# EasyEDA Pro project 【JHP硬件工作室】参考工程.epro

# Schematic user
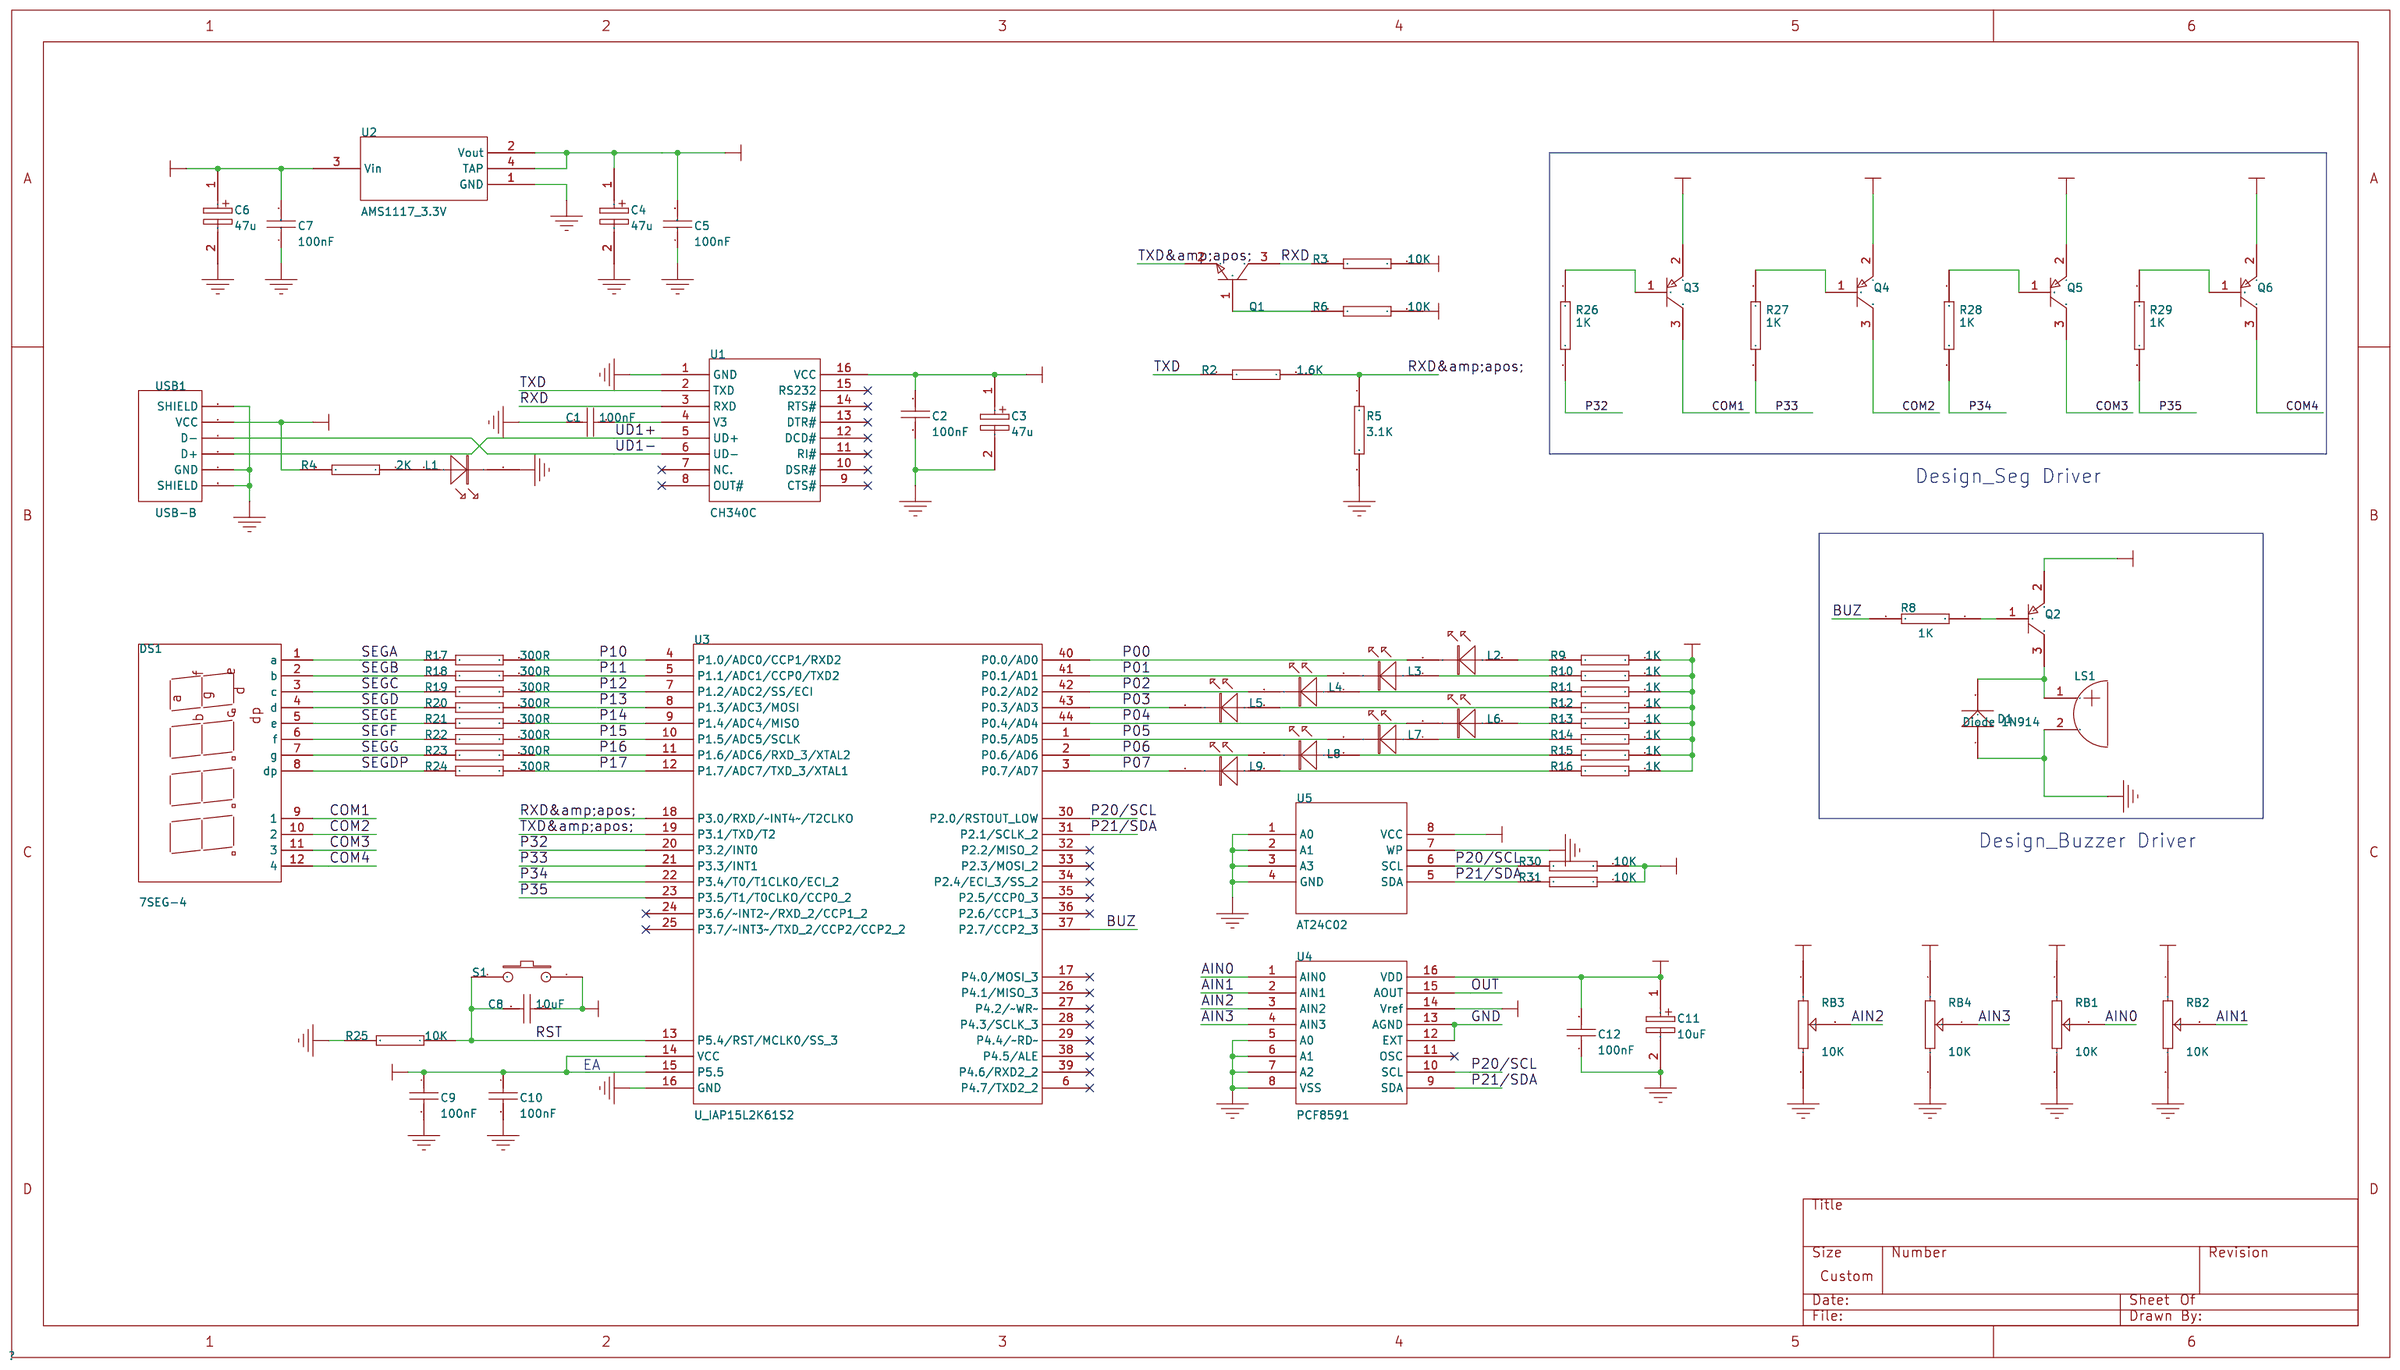
[diagram p0: schematic sheet]

## Parts
C1  100nF  [C0805]
C2  100nF  [C0805]
C3  47u  [CAP-2]
C4  47u  [CAP-2]
C5  100nF  [C0805]
C6  47u  [CAP-2]
C7  100nF  [C0805]
C8  10uF  [C0805]
C9  100nF  [C0805]
C10  100nF  [C0805]
C11  10uF  [CAP-2]
C12  100nF  [C0805]
D1  Diode 1N914  [DIODE]
DS1  7SEG-4  [D_SEG-0.36]
L1  LED  [LED0805]
L2  LED  [LED0805]
L3  LED  [LED0805]
L4  LED  [LED0805]
L5  LED  [LED0805]
L6  LED  [LED0805]
L7  LED  [LED0805]
L8  LED  [LED0805]
L9  LED  [LED0805]
LS1  S_BUZZER  [BUZZ]
Q1  8050-SOT23  [SOT23-3]
Q2  2N3906  [SOT23-3]
Q3  2N3906  [SOT23-3]
Q4  2N3906  [SOT23-3]
Q5  2N3906  [SOT23-3]
Q6  2N3906  [SOT23-3]
R2  1.6K  [R0805]
R3  10K  [R0805]
R4  2K  [R0805]
R5  3.1K  [R0805]
R6  10K  [R0805]
R8  1K  [R0805]
R9  1K  [R0805]
R10  1K  [R0805]
R11  1K  [R0805]
R12  1K  [R0805]
R13  1K  [R0805]
R14  1K  [R0805]
R15  1K  [R0805]
R16  1K  [R0805]
R17  300R  [R0805]
R18  300R  [R0805]
R19  300R  [R0805]
R20  300R  [R0805]
R21  300R  [R0805]
R22  300R  [R0805]
R23  300R  [R0805]
R24  300R  [R0805]
R25  10K  [R0805]
R26  1K  [R0805]
R27  1K  [R0805]
R28  1K  [R0805]
R29  1K  [R0805]
R30  10K  [R0805]
R31  10K  [R0805]
RB1  10K  [RB]
RB2  10K  [RB]
RB3  10K  [RB]
RB4  10K  [RB]
S1  SW-PB  [Switch]
U1  CH340C  [SO-16_N]
U2  AMS1117_3.3V  [SOT-223]
U3  U_IAP15L2K61S2  [LQFP-44]
U4  PCF8591  [SO-16_W]
U5  AT24C02  [SO-8]
USB1  USB-B  [USB-B]

## Library data of the parts
C1 C2 C9 C10 = 100nF: Design Item ID: CAP; Library Name: *
C3 C4 C6 = 47u: Electrolytic Capacitor; Library Name: user
C5 C7 = 100nF: Capacitor; 中文名称: 贴片电容; Design Item ID: C_CAP; Library Name: Altium-library
C8 = 10uF: Design Item ID: CAP; Library Name: *
C11 = 10uF: Electrolytic Capacitor; Design Item ID: ELECTRO2; Library Name: *
C12 = 100nF: Capacitor; Design Item ID: CAP; Library Name: *
D1 = Diode 1N914: High Conductance Fast Diode; Library Name: Miscellaneous Devices
DS1 = 7SEG-4: 4 Seven-Segment Display, Right Hand Decimal; Library Name: *
L1-L9 = LED: Library Name: *
LS1 = S_BUZZER: Library Name: Altium
Q1 = 8050-SOT23: PNP-S8050; 中文名称: 三极管; Design Item ID: Q_NPN; Library Name: Altium
Q2-Q6 = 2N3906: PNP General Purpose Amplifier; Library Name: Miscellaneous Devices
R2 = 1.6K: Design Item ID: RES2; Library Name: *
R3 R6 R25 R30 R31 = 10K: Design Item ID: RES2; Library Name: *
R4 = 2K: Design Item ID: RES2; Library Name: *
R5 = ?: Design Item ID: RES2; Library Name: *
R8-R16 R26-R29 = 1K: Design Item ID: RES2; Library Name: *
R17-R24 = 300R: Design Item ID: RES2; Library Name: *
RB1-RB4 = 10K: Potentiometer; Design Item ID: POT2; Library Name: *
S1 = SW-PB: Library Name: user
U1 = CH340C: Library Name: user
U2 = AMS1117_3.3V: POWER; 中文名称: 稳压芯片; Design Item ID: U_ASM1117; Library Name: Altium-library
U3 = U_IAP15L2K61S2: MCU; 中文名称: STC15系列单片机; Design Item ID: U_IAP15F2K61S2; Library Name: Company-library_2018年11月21日
U4 = PCF8591: Library Name: *
U5 = AT24C02: Library Name: *
USB1 = USB-B: Connector; Design Item ID: USB_A; Library Name: *

## Nets
+3V3: C4.1 C5.2 C8.2 C9.1 C10.1 C11.1 C12.2 Q2.2(E) Q3.2(E) Q4.2(E) Q5.2(E) Q6.2(E) R6.1 R9.2 R10.2 R11.2 R12.2 R13.2 R14.2 R15.2 R16.2 R30.1 R31.1 RB1.1 RB2.1 RB3.1 RB4.1 S1.2 U2.2(Vout) U2.4(TAP) U3.14(VCC) U3.15(P5.5) U4.14(Vref) U4.16(VDD) U5.8(VCC)
+5V: C2.1 C3.1 C6.1 C7.2 R3.1 R4.2 U1.16(VCC) U2.3(Vin) USB1.1(VCC)
GND: C1.1 C2.2 C3.2 C4.2 C5.1 C6.2 C7.1 C9.2 C10.2 C11.2 C12.1 D1.1(A) L1.2(K) LS1.2 R5.2 R25.2 RB1.3(2) RB2.3(2) RB3.3(2) RB4.3(2) U1.1(GND) U2.1(GND) U3.16(GND) U4.5(A0) U4.6(A1) U4.7(A2) U4.8(VSS) U4.12(EXT) U4.13(AGND) U5.1(A0) U5.2(A1) U5.3(A3) U5.4(GND) U5.7(WP) USB1.4(GND) USB1.5(SHIELD) USB1.6(SHIELD)
AIN0: RB1.2(W) U4.1(AIN0)
AIN1: RB2.2(W) U4.2(AIN1)
AIN2: RB3.2(W) U4.3(AIN2)
AIN3: RB4.2(W) U4.4(AIN3)
BUZ: R8.1 U3.37(P2.7/CCP2_3)
COM1: DS1.9(1) Q3.3(C)
COM2: DS1.10(2) Q4.3(C)
COM3: DS1.11(3) Q5.3(C)
COM4: DS1.12(4) Q6.3(C)
OUT: U4.15(AOUT)
P00: L2.2(K) U3.40(P0.0/AD0)
P01: L3.2(K) U3.41(P0.1/AD1)
P02: L4.2(K) U3.42(P0.2/AD2)
P03: L5.2(K) U3.43(P0.3/AD3)
P04: L6.2(K) U3.44(P0.4/AD4)
P05: L7.2(K) U3.1(P0.5/AD5)
P06: L8.2(K) U3.2(P0.6/AD6)
P07: L9.2(K) U3.3(P0.7/AD7)
P10: R17.2 U3.4(P1.0/ADC0/CCP1/RXD2)
P11: R18.2 U3.5(P1.1/ADC1/CCP0/TXD2)
P12: R19.2 U3.7(P1.2/ADC2/SS/ECI)
P13: R20.2 U3.8(P1.3/ADC3/MOSI)
P14: R21.2 U3.9(P1.4/ADC4/MISO)
P15: R22.2 U3.10(P1.5/ADC5/SCLK)
P16: R23.2 U3.11(P1.6/ADC6/RXD_3/XTAL2)
P17: R24.2 U3.12(P1.7/ADC7/TXD_3/XTAL1)
P20/SCL: R30.2 U3.30(P2.0/RSTOUT_LOW) U4.10(SCL) U5.6(SCL)
P21/SDA: R31.2 U3.31(P2.1/SCLK_2) U4.9(SDA) U5.5(SDA)
P32: R26.1 U3.20(P3.2/INT0)
P33: R27.1 U3.21(P3.3/INT1)
P34: R28.1 U3.22(P3.4/T0/T1CLKO/ECI_2)
P35: R29.1 U3.23(P3.5/T1/T0CLKO/CCP0_2)
RST: C8.1 R25.1 S1.1 U3.13(P5.4/RST/MCLK0/SS_3)
RXD: Q1.3(C) R3.2 U1.3(RXD)
RXD&amp;apos;: R2.1 R5.1 U3.18(P3.0/RXD/~INT4~/T2CLKO)
SEGA: DS1.1(a) R17.1
SEGB: DS1.2(b) R18.1
SEGC: DS1.3(c) R19.1
SEGD: DS1.4(d) R20.1
SEGDP: DS1.8(dp) R24.1
SEGE: DS1.5(e) R21.1
SEGF: DS1.6(f) R22.1
SEGG: DS1.7(g) R23.1
TXD: R2.2 U1.2(TXD)
TXD&amp;apos;: Q1.2(E) U3.19(P3.1/TXD/T2)
UD1+: U1.5(UD+) USB1.3(D+)
UD1-: U1.6(UD-) USB1.2(D-)
$1N776: L2.1(A) R9.1
$1N777: L4.1(A) R11.1
$1N778: L5.1(A) R12.1
$1N779: L7.1(A) R14.1
$1N780: L8.1(A) R15.1
$1N781: L9.1(A) R16.1
$1N782: L3.1(A) R10.1
$1N783: L6.1(A) R13.1
$1N790: C1.2 U1.4(V3)
$1N933: Q1.1(B) R6.2
$1N948: L1.1(A) R4.1
$1N2567: Q3.1(B) R26.2
$1N2650: Q4.1(B) R27.2
$1N2787: Q5.1(B) R28.2
$1N2856: Q6.1(B) R29.2
$1N2876: Q2.1(B) R8.2
$1N2914: D1.2(K) LS1.1 Q2.3(C)

Not connected (* = marked no-connect by the designer): U1 7(NC.)* 8(OUT#)* 9(CTS#)* 10(DSR#)* 11(RI#)* 12(DCD#)* 13(DTR#)* 14(RTS#)* 15(RS232)*; U3 6(P4.7/TXD2_2)* 17(P4.0/MOSI_3)* 24(P3.6/~INT2~/RXD_2/CCP1_2)* 25(P3.7/~INT3~/TXD_2/CCP2/CCP2_2)* 26(P4.1/MISO_3)* 27(P4.2/~WR~)* 28(P4.3/SCLK_3)* 29(P4.4/~RD~)* 32(P2.2/MISO_2)* 33(P2.3/MOSI_2)* 34(P2.4/ECI_3/SS_2)* 35(P2.5/CCP0_3)* 36(P2.6/CCP1_3)* 38(P4.5/ALE)* 39(P4.6/RXD2_2)*; U4 11(OSC)*

## Notes on the sheet
- Design_Seg Driver
- Design_Buzzer Driver
- EA

# Board user
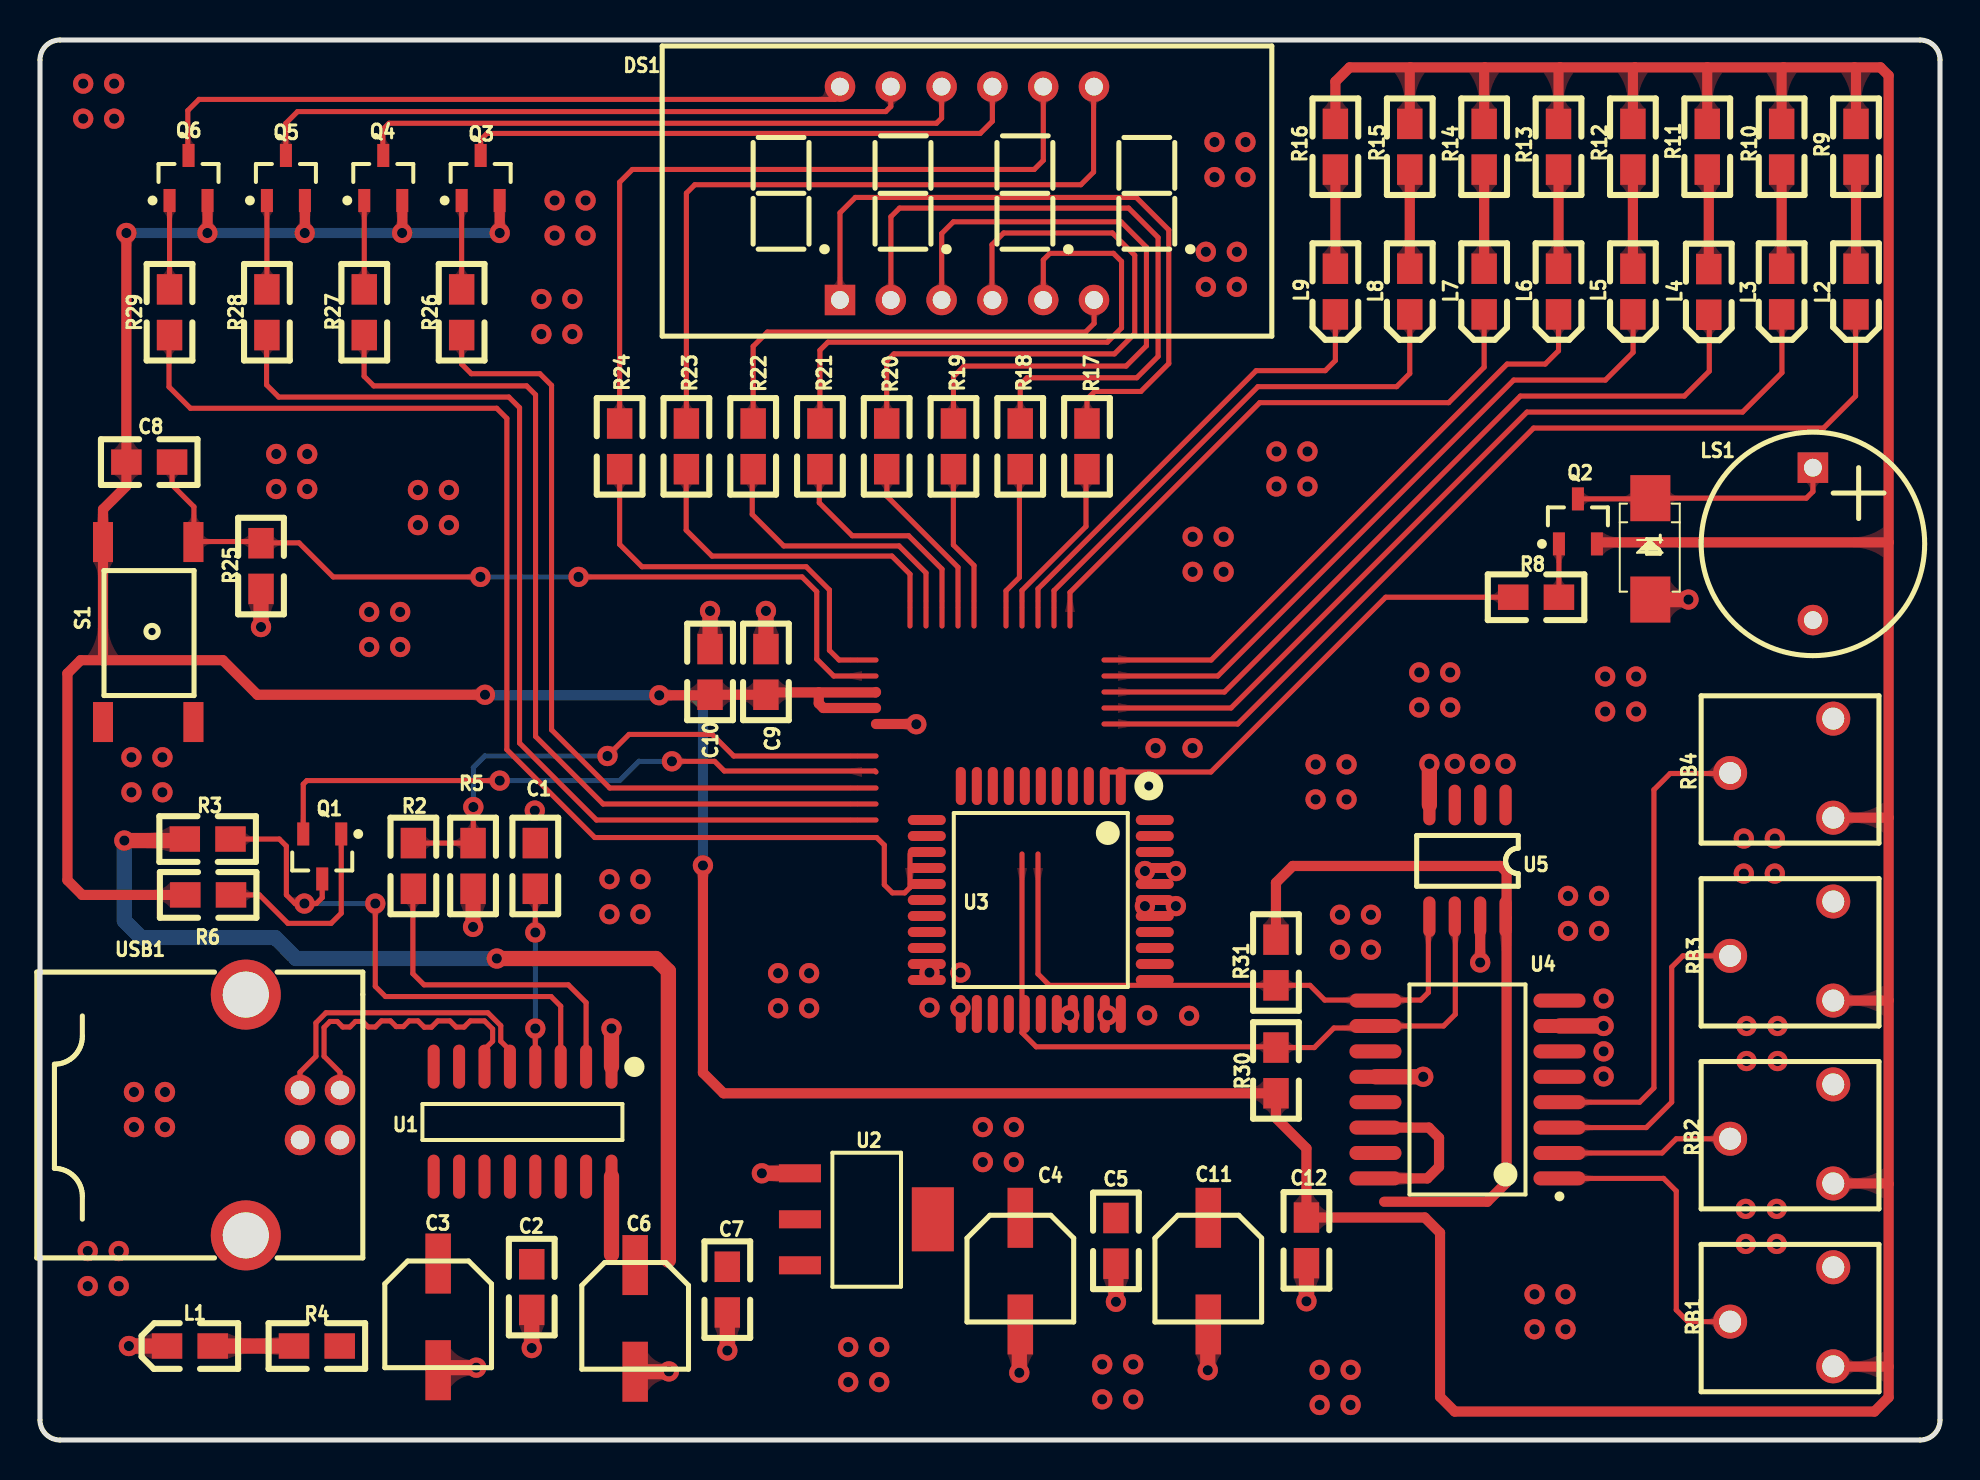
[diagram p1: board, top side]
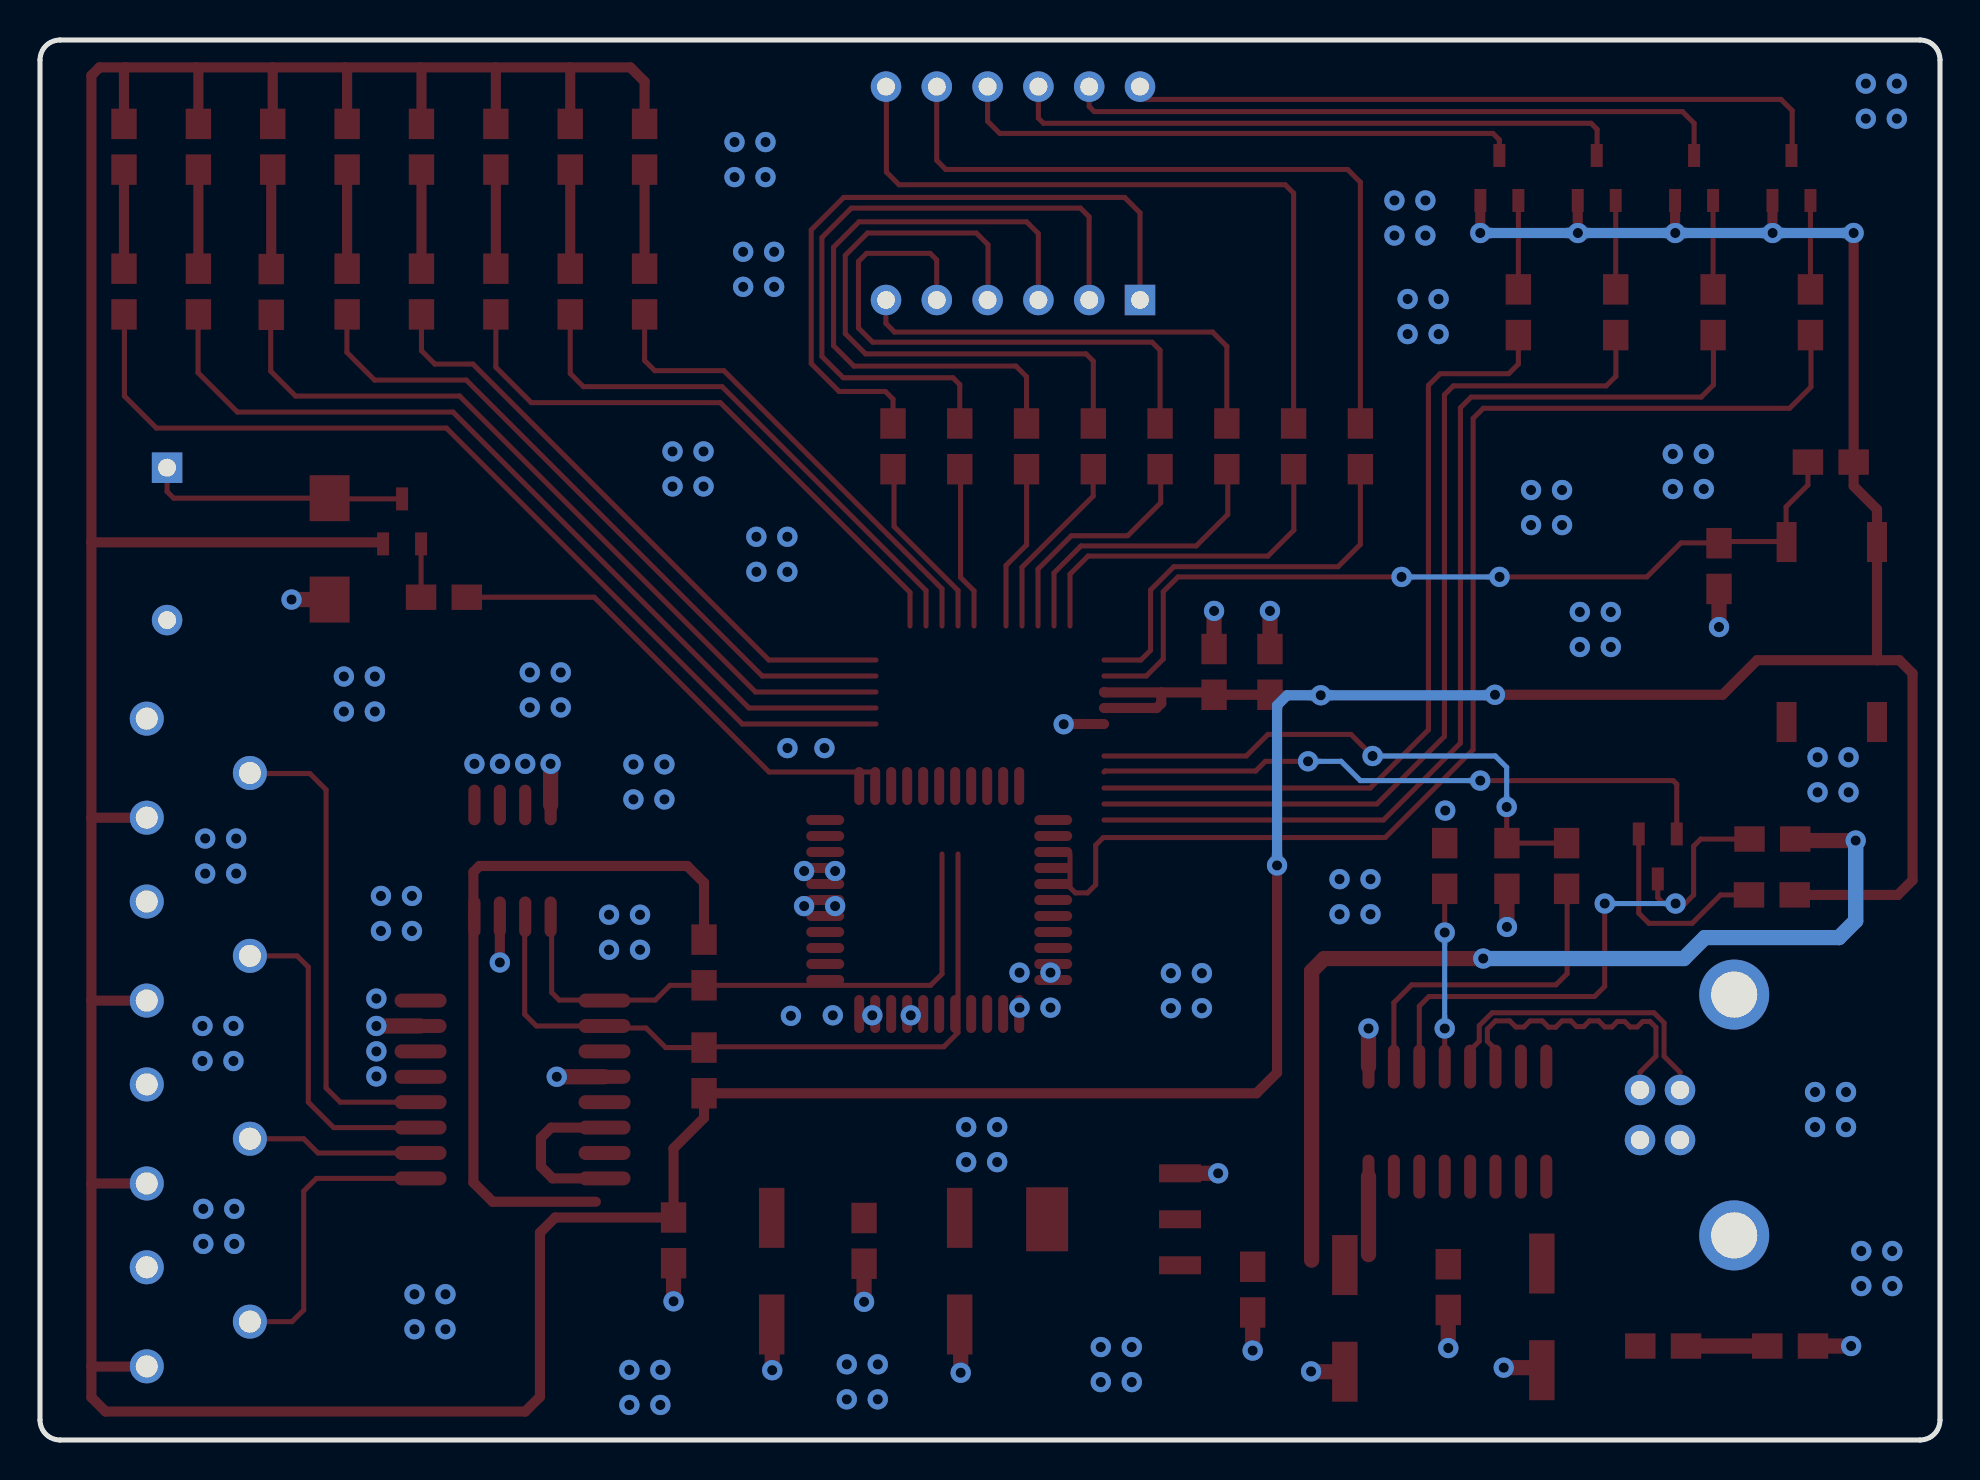
[diagram p2: board, bottom side, seen from below]

Outline 95 x 70 mm; copper layers: Top Layer, Bottom Layer. Coordinates in mm from the lower left corner of the outline.
Outline path: 0,69 0,1 arc(0.29,0.29) 1,0 94,0 arc(94.71,0.29) 95,1 95,69 arc(94.71,69.71) 94,70 1,70 arc(0.29,69.71) 0,69
Stack: Top Layer 0.035mm / Dielectric1 1.51mm FR4 er 4.5 / Bottom Layer 0.035mm

## Design rules (mm)
net UD1-: DP1
net UD1+: DP1
template: 自定义配置
spacing copperThickness1oz (default): track to track 0.254, other pairs 0.254 to 0.762
spacing copperThickness2oz: track to track 0.203, other pairs 0.152 to 0.3
track width copperThickness1oz (default): min 0.254, default 0.254, max 1.27
track width copperThickness2oz: min 0.203, default 0.254, max 2.54
track width 3V3: min 0.508, default 0.508, max 0.508
track width 5V: min 0.762, default 0.762, max 0.762
differential pair differentialPair (default): width min 0.127, default 0.254, max 2.54; gap min 0.152, default 0.152
via viaSize (default): diameter min 1.016, default 1.016, max 1.016; hole min 0.508, default 0.508, max 0.508
net +5V uses 5V
net +3V3 uses 3V3

## Placement (name value [footprint] x y rotation side)
C1  100nF  [C0805]  24.77 29.84 270 top
C2  100nF  [C0805]  24.59 8.79 270 top
C3  47u  [CAP-2]  19.41 7.19 270 top
C4  47u  [CAP-2]  48.51 9.47 270 top
C5  100nF  [C0805]  53.8 8.81 90 top
C6  47u  [CAP-2]  29.26 7.11 270 top
C7  100nF  [C0805]  34.37 6.38 90 top
C8  10uF  [C0805]  6.6 48.89 180 top
C9  100nF  [C0805]  36.3 37.26 90 top
C10  100nF  [C0805]  33.5 37.26 90 top
C11  10uF  [CAP-2]  57.91 9.47 270 top
C12  100nF  [C0805]  63.32 8.84 90 top
D1  Diode 1N914  [DIODE]  80.52 42.01 90 top
DS1  7SEG-4  [D_SEG-0.36]  40 57 0 top
L1  LED  [LED0805]  6.35 4.7 0 top
L2  LED  [LED0805]  90.8 56.28 90 top
L3  LED  [LED0805]  87.08 56.28 90 top
L4  LED  [LED0805]  83.44 56.26 90 top
L5  LED  [LED0805]  79.64 56.28 90 top
L6  LED  [LED0805]  75.93 56.28 90 top
L7  LED  [LED0805]  72.21 56.28 90 top
L8  LED  [LED0805]  68.49 56.28 90 top
L9  LED  [LED0805]  64.77 56.28 90 top
LS1  S_BUZZER  [BUZZ]  88.65 48.62 270 top
Q1  8050-SOT23  [SOT23-3]  15.06 30.3 270 top
Q2  2N3906  [SOT23-3]  75.95 44.81 90 top
Q3  2N3906  [SOT23-3]  21.08 61.98 90 top
Q4  2N3906  [SOT23-3]  16.21 61.98 90 top
Q5  2N3906  [SOT23-3]  11.35 61.98 90 top
Q6  2N3906  [SOT23-3]  6.48 61.98 90 top
R2  1.6K  [R0805]  18.67 29.84 270 top
R3  10K  [R0805]  7.24 30.05 0 top
R4  2K  [R0805]  12.7 4.7 0 top
R5  3.1K  [R0805]  21.65 29.84 270 top
R6  10K  [R0805]  7.26 27.25 0 top
R8  1K  [R0805]  73.66 42.14 0 top
R9  1K  [R0805]  90.8 63.52 90 top
R10  1K  [R0805]  87.08 63.52 90 top
R11  1K  [R0805]  83.36 63.52 90 top
R12  1K  [R0805]  79.64 63.52 90 top
R13  1K  [R0805]  75.93 63.52 90 top
R14  1K  [R0805]  72.21 63.52 90 top
R15  1K  [R0805]  68.49 63.52 90 top
R16  1K  [R0805]  64.77 63.52 90 top
R17  300R  [R0805]  52.35 50.83 270 top
R18  300R  [R0805]  49.01 50.83 270 top
R19  300R  [R0805]  45.67 50.83 270 top
R20  300R  [R0805]  42.33 50.83 270 top
R21  300R  [R0805]  39 50.83 270 top
R22  300R  [R0805]  35.66 50.83 270 top
R23  300R  [R0805]  32.32 50.83 270 top
R24  300R  [R0805]  28.98 50.83 270 top
R25  10K  [R0805]  11.05 44.84 270 top
R26  1K  [R0805]  21.08 55.25 90 top
R27  1K  [R0805]  16.21 55.25 90 top
R28  1K  [R0805]  11.35 55.25 90 top
R29  1K  [R0805]  6.48 55.25 90 top
R30  10K  [R0805]  61.8 17.34 90 top
R31  10K  [R0805]  61.8 25.02 270 top
RB1  10K  [RB]  89.66 3.68 270 top
RB2  10K  [RB]  89.66 12.83 270 top
RB3  10K  [RB]  89.66 21.97 270 top
RB4  10K  [RB]  89.66 31.11 270 top
S1  SW-PB  [Switch]  5.46 40.39 90 top
U1  CH340C  [SO-16_N]  28.57 18.67 270 top
U2  AMS1117_3.3V  [SOT-223]  38 13.33 0 top
U3  U_IAP15L2K61S2  [LQFP-44]  47.5 35 270 top
U4  PCF8591  [SO-16_W]  71.37 17.53 180 top
U5  AT24C02  [SO-8]  73.28 31.75 270 top
USB1  -  [USB-B]  15 15 270 top

## Footprints (pads in the part's own frame, mm; a bottom-side part is the same pattern mirrored in y, then rotated)
BUZZ
  rect 1.524x1.524 hole 0.889: 1(0,0)
  round 1.524 hole 0.889: 2(7.62,0)
C0805
  rect 1.524x1.27 smd: 1(0,0) 2(2.286,0)
CAP-2
  rect 3x1.274 smd: 1(-1.635,0.502) 2(3.699,0.502)
D_SEG-0.36
  rect 1.524x1.524 hole 0.889: 1(0,0)
  round 1.524 hole 0.889: 2(2.54,0) 3(5.08,0) 4(7.62,0) 5(10.16,0) 6(12.7,0) 7(12.7,10.668) 8(10.16,10.668) 9(7.62,10.668) 10(5.08,10.668) 11(2.54,10.668) 12(0,10.668)
DIODE
  rect 2.3x2 smd: 1(0.01,0) 2(5.08,0)
LED0805
  rect 1.524x1.27 smd: 1(2.286,0) 2(0,0)
LQFP-44
  oval 1.9x0.5 smd: 1(2.301,6.54) 2(2.301,5.74) 3(2.301,4.94) 4(2.301,4.14) 5(2.301,3.34) 6(2.301,2.54) 7(2.301,1.74) 8(2.301,0.94) 9(2.301,0.14) 10(2.301,-0.66) 11(2.301,-1.46) 23(13.701,-1.46) 24(13.701,-0.66) 25(13.701,0.14) 26(13.701,0.94) 27(13.701,1.74) 28(13.701,2.54) 29(13.701,3.34) 30(13.701,4.14) 31(13.701,4.94) 32(13.701,5.74) 33(13.701,6.54)
  oval 0.5x1.9 smd: 12(4.001,-3.16) 13(4.801,-3.16) 14(5.601,-3.16) 15(6.401,-3.16) 16(7.201,-3.16) 17(8.001,-3.16) 18(8.801,-3.16) 19(9.601,-3.16) 20(10.401,-3.16) 21(11.201,-3.16) 22(12.001,-3.16) 34(12.001,8.24) 35(11.201,8.24) 36(10.401,8.24) 37(9.601,8.24) 38(8.801,8.24) 39(8.001,8.24) 40(7.201,8.24) 41(6.401,8.24) 42(5.601,8.24) 43(4.801,8.24) 44(4.001,8.24)
R0805
  rect 1.524x1.27 smd: 1(0,0) 2(2.286,0)
RB
  round 1.7 hole 1.1: 1(0,0) 2(-2.235,-5.156) 3(-4.953,0)
SO-8
  oval 2.032x0.61 smd: 1(0,0) 2(0,-1.27) 3(0,-2.54) 4(0,-3.81) 5(5.588,-3.81) 6(5.588,-2.54) 7(5.588,-1.27) 8(5.588,0)
SO-16_N
  oval 2.2x0.6 smd: 1(0,0) 2(0,-1.27) 3(0,-2.54) 4(0,-3.81) 5(0,-5.08) 6(0,-6.35) 7(0,-7.62) 8(0,-8.89) 9(5.5,-8.89) 10(5.5,-7.62) 11(5.5,-6.35) 12(5.5,-5.08) 13(5.5,-3.81) 14(5.5,-2.54) 15(5.5,-1.27) 16(5.5,0)
SO-16_W
  oval 2.6x0.7 smd: 1(-4.6,4.445) 2(-4.6,3.175) 3(-4.6,1.905) 4(-4.6,0.635) 5(-4.6,-0.635) 6(-4.6,-1.905) 7(-4.6,-3.175) 8(-4.6,-4.445) 9(4.6,-4.445) 10(4.6,-3.175) 11(4.6,-1.905) 12(4.6,-0.635) 13(4.6,0.635) 14(4.6,1.905) 15(4.6,3.175) 16(4.6,4.445)
SOT23-3
  rect 1.15x0.6 smd: 1(0,0) 2(0,-1.9) 3(2.25,-0.95)
SOT-223
  rect 2.1x0.9 smd: 1(0,0) 2(0,-2.3) 3(0,-4.6)
  rect 2.1x3.2 smd: 4(6.644,-2.3)
Switch
  rect 2x1 smd: 1(4.503,-2.208) 2(4.503,2.312) 3(-4.497,2.312) 4(-4.497,-2.208)
USB-B
  round 1.524 hole 0.92: 1(0,0) 2(-2.5,0) 3(-2.5,-2) 4(0,-2)
  round 3.5 hole 2.3: 5(4.77,-4.71) 6(-7.27,-4.71)

## Nets
As in the schematic, except:
RXD&APOS;: R2.1 R5.1 U3.18
TXD&APOS;: Q1.2 U3.19

Pads without a net: S1 3 4; U1 7 8 9 10 11 12 13 14 15; U3 6 17 24 25 26 27 28 29 32 33 34 35 36 38 39; U4 11

## Via types
v1: diameter 1.016, hole 0.508, Top Layer to Bottom Layer, 174 vias

## Routing (per net, layer and track width the routed paths; a pad name or vN(x,y) marks a point on that pad's centre or on a via; arc(x,y) is an arc through that point)
+3V3: length 390.6
  Top Layer w0.508: 76,68.63 75.93,68.56 R13.2 ; 76,68.63 79.74,68.63 ; 76,68.63 72.24,68.63 ; R11.2 83.36,68.63 ; 83.36,68.63 79.74,68.63 ; 83.36,68.63 87.18,68.63 ; RB2.1 92.41,12.83 92.43,12.8 ; Q3.2 22.99,61.97 v1(22.99,60.35) ; 3.15,38.99 2.03,38.99 1.37,38.33 1.37,27.99 2.11,27.25 R6.1 ; 3.15,38.99 9.14,38.99 10.87,37.26 v1(22.25,37.26) ; 3.15,38.99 S1.2 3.15,46.53 4.32,47.7 C8.2 v1(4.32,60.35) ; 38.94,37.38 41.78,37.38 41.8,37.4 ; 38.94,37.38 38.94,36.83 39.17,36.6 41.8,36.6 ; 38.94,37.38 36.41,37.38 C9.1 C10.1 33.48,37.24 v1(30.96,37.24) ; 72.24,68.63 68.51,68.63 ; 72.24,68.63 72.21,68.6 R14.2 ; 68.51,68.63 65.48,68.63 64.77,67.92 R16.2 ; 68.51,68.63 68.49,68.61 R15.2 ; R9.2 90.8,68.56 90.72,68.63 ; 92.43,44.89 92.43,44.88 77.92,44.88 Q2.2 ; 92.43,44.89 92.43,31.12 ; 92.43,44.89 92.43,68.22 92.02,68.63 90.72,68.63 ; U4.14 69.44,15.62 69.95,15.11 69.95,13.67 69.37,13.08 U4.16 ; 67.21,11.91 72.36,11.91 73.33,12.88 73.33,26.11 ; 92.43,12.8 92.43,21.98 ; 92.43,12.8 92.43,3.67 ; 8.38,61.98 8.38,60.38 ; 92.43,21.98 92.42,21.97 RB3.1 ; 92.43,21.98 92.43,31.12 ; 92.43,3.67 89.68,3.67 RB1.1 ; 92.43,3.67 92.43,2.13 91.72,1.42 70.74,1.42 70,2.16 70,10.36 69.24,11.12 C12.2 63.32,14.58 61.8,16.1 R30.1 34.18,17.34 33.15,18.36 v1(33.15,28.73) ; R31.1 61.8,27.86 62.64,28.7 73.03,28.7 73.33,28.4 73.33,26.11 ; R10.2 87.08,68.53 87.18,68.63 ; Q4.2 18.11,60.38 ; R12.2 79.64,68.53 79.74,68.63 ; 87.18,68.63 90.72,68.63 ; 73.33,26.11 U5.8 ; 92.43,31.12 92.42,31.11 RB4.1 ; Q5.2 13.25,60.38
  Bottom Layer w0.508: v1(33.15,28.73) 33.15,36.73 32.64,37.24 v1(30.96,37.24) 22.28,37.24 v1(22.25,37.26) ; v1(22.99,60.35) v1(18.11,60.35) v1(13.24,60.35) v1(8.37,60.35) v1(4.32,60.35)
+5V: length 53.7
  Top Layer w0.762: 31.42,8.99 31.42,23.44 30.79,24.07 v1(22.84,24.07) ; v1(4.22,29.97) 7.16,29.97 R3.1 ; U1.16 28.57,9.27
  Bottom Layer w0.762: v1(4.22,29.97) 4.22,25.96 5.05,25.12 11.76,25.12 12.81,24.07 v1(22.84,24.07)
GND: length 42.1
  Top Layer w0.508: v1(43.81,35.79) 43.8,35.8 41.8,35.8 ; U5.7 v1(72.01,23.88)
  Top Layer w0.762: C6.2 31.43,3.41 v1(31.44,3.43) ; v1(63.32,6.93) C12.1 ; v1(33.5,41.45) C10.2 ; v1(34.37,4.47) C7.1 ; v1(58.39,3.49) 58.39,5.75 58.41,5.78 ; v1(11.05,40.65) R25.2 ; v1(53.8,6.91) C5.1 ; v1(36.3,41.45) C9.2 ; v1(24.59,4.6) C2.2 ; v1(21.81,3.62) 19.91,3.62 ; v1(78.18,20.7) U4.7 ; L1.2 v1(4.44,4.7) ; v1(82.42,42.02) D1.1 ; v1(69.16,18.16) U4.12 ; v1(48.97,3.36) 48.97,5.72 49.02,5.78 ; v1(36.09,13.33) U2.1 ; v1(21.65,25.65) R5.2 ; v1(69.47,33.81) U5.4 ; v1(28.57,20.57) U1.1
  vias: v1(2.16,67.82) v1(2.16,66.07) v1(2.39,9.45) v1(2.39,7.7) v1(3.71,67.82) v1(3.71,66.07) v1(3.94,9.45) v1(3.94,7.7) v1(4.57,34.14) v1(4.57,32.39) v1(4.7,17.4) v1(4.7,15.65) v1(6.12,34.14) v1(6.12,32.39) v1(6.25,17.4) v1(6.25,15.65) v1(11.81,49.3) v1(11.81,47.55) v1(13.36,49.3) v1(13.36,47.55) v1(16.46,41.4) v1(16.46,39.65) v1(18.01,41.4) v1(18.01,39.65) v1(18.9,47.5) v1(18.9,45.75) v1(20.45,47.5) v1(20.45,45.75) v1(24.74,31.47) v1(25.07,57.05) v1(25.07,55.3) v1(25.73,61.98) v1(25.73,60.22) v1(26.62,57.05) v1(26.62,55.3) v1(27.28,61.98) v1(27.28,60.22) v1(28.47,28.04) v1(28.47,26.29) v1(30.02,28.04) v1(30.02,26.29) v1(36.91,23.34) v1(36.91,21.59) v1(38.46,23.34) v1(38.46,21.59) v1(40.41,4.65) v1(40.41,2.9) v1(41.96,4.65) v1(41.96,2.9) v1(44.48,23.37) v1(44.48,21.62) v1(46.03,23.37) v1(46.03,21.62) v1(47.14,15.65) v1(47.14,13.89) v1(48.69,15.65) v1(48.69,13.89) v1(51.46,21.23) v1(53.11,3.78) v1(53.11,2.03) v1(53.38,21.23) v1(54.66,3.78) v1(54.66,2.03) v1(55.25,28.45) v1(55.25,26.7) v1(55.36,21.23) v1(55.78,34.59) v1(56.79,28.45) v1(56.79,26.7) v1(57.46,21.21) v1(57.63,45.16) v1(57.63,43.41) v1(57.63,34.59) v1(58.29,59.41) v1(58.29,57.66) v1(58.72,64.9) v1(58.72,63.14) v1(59.18,45.16) v1(59.18,43.41) v1(59.84,59.41) v1(59.84,57.66) v1(60.27,64.9) v1(60.27,63.14) v1(61.82,49.43) v1(61.82,47.68) v1(63.37,49.43) v1(63.37,47.68) v1(63.78,33.78) v1(63.78,32.03) v1(63.98,3.5) v1(63.98,1.75) v1(65,26.26) v1(65,24.51) v1(65.33,33.78) v1(65.33,32.03) v1(65.53,3.5) v1(65.53,1.75) v1(66.55,26.26) v1(66.55,24.51) v1(68.96,38.38) v1(68.96,36.63) v1(70.51,38.38) v1(70.51,36.63) v1(70.74,33.81) v1(72,33.81) v1(73.28,33.81) v1(74.73,7.29) v1(74.73,5.54) v1(76.28,7.29) v1(76.28,5.54) v1(76.4,27.2) v1(76.4,25.45) v1(77.95,27.2) v1(77.95,25.45) v1(78.18,22.07) v1(78.18,19.43) v1(78.18,18.18) v1(78.26,38.18) v1(78.26,36.42) v1(79.81,38.18) v1(79.81,36.42) v1(85.19,30.07) v1(85.19,28.32) v1(85.33,20.7) v1(85.33,18.95) v1(85.29,11.56) v1(85.29,9.8) v1(86.74,30.07) v1(86.74,28.32) v1(86.84,11.56) v1(86.84,9.8) v1(86.88,20.7) v1(86.88,18.95)
AIN0: length 15
  Top Layer w0.254: RB1.2 82.4,5.92 81.81,6.5 81.81,12.45 81.18,13.08 U4.1
AIN1: length 8.8
  Top Layer w0.254: RB2.2 81.81,15.06 81.1,14.35 U4.2
AIN2: length 16
  Top Layer w0.254: U4.3 80.31,15.62 81.59,16.89 81.59,23.65 82.14,24.21 RB3.2
AIN3: length 24.1
  Top Layer w0.254: 75.97,16.89 79.98,16.89 80.7,17.6 80.7,32.51 81.51,33.33 84.48,33.33 RB4.2
BUZ: length 24.1
  Top Layer w0.254: R8.1 67.28,42.14 58.55,33.4 53.2,33.4
COM1: length 28.5
  Top Layer w0.254: Q3.3 22.03,65.01 22.35,65.33 47.01,65.33 47.62,65.94 DS1.9
COM2: length 31.1
  Top Layer w0.254: Q4.3 17.14,64.24 17.14,65.53 17.45,65.84 44.83,65.84 45.08,66.09 DS1.10
COM3: length 33.2
  Top Layer w0.254: DS1.11 42.54,66.67 42.29,66.42 12.88,66.42 12.29,65.84 12.29,64.23
COM4: length 35.6
  Top Layer w0.254: DS1.12 40,67.28 39.75,67.03 7.95,67.03 7.39,66.47 7.39,64.26 Q6.3
P00: length 48.5
  Top Layer w0.254: L2.2 90.78,56.26 90.78,52.2 89.18,50.6 74.68,50.6 59.88,35.8 53.2,35.8
P01: length 43.8
  Top Layer w0.254: 53.2,36.6 59.55,36.6 74.35,51.4 85.13,51.4 87.1,53.37 87.1,56.26 L3.2
P02: length 39.7
  Top Layer w0.254: L4.2 83.46,56.24 83.46,53.44 82.22,52.2 74.02,52.2 59.22,37.4 53.2,37.4
P03: length 35.1
  Top Layer w0.254: 53.2,38.2 58.89,38.2 73.69,53 78.27,53 79.65,54.38 79.65,56.27 L5.2
P04: length 30.9
  Top Layer w0.254: L6.2 75.93,54.46 75.26,53.8 73.35,53.8 58.56,39 53.2,39
P05: length 29.7
  Top Layer w0.254: 51.5,40.7 51.5,42.38 60.99,51.87 70.43,51.87 72.21,53.64 L7.2
P06: length 27
  Top Layer w0.254: 50.7,40.7 50.7,42.47 60.9,52.67 67.83,52.67 68.49,53.33 L8.2
P07: length 23.8
  Top Layer w0.254: L9.2 64.77,53.97 64.26,53.47 60.81,53.47 49.9,42.56 49.9,40.7
P10: length 9.2
  Top Layer w0.254: 49.1,40.7 49.1,42.48 52.3,45.68 52.3,48.49 R17.2
P11: length 8.1
  Top Layer w0.254: R18.2 48.97,48.5 48.97,43.13 48.3,42.46 48.3,40.7
P12: length 8.3
  Top Layer w0.254: R19.2 45.67,48.54 45.67,44.75 46.7,43.72 46.7,40.7
P13: length 9.3
  Top Layer w0.254: R20.2 42.34,48.53 42.34,47.19 45.9,43.64 45.9,40.7
P14: length 12
  Top Layer w0.254: R21.2 38.96,48.51 38.96,46.86 40.61,45.21 43.43,45.21 45.1,43.55 45.1,40.7
P15: length 14.8
  Top Layer w0.254: R22.2 35.61,48.49 35.61,46.28 37.19,44.7 42.95,44.7 44.3,43.36 44.3,40.7
P16: length 17.7
  Top Layer w0.254: R23.2 32.31,48.53 32.31,45.49 33.6,44.2 42.6,44.2 43.5,43.29 43.5,40.7
P17: length 20.7
  Top Layer w0.254: R24.2 28.98,44.78 30.1,43.66 38.31,43.66 39.47,42.5 39.47,39.48 39.95,39 41.8,39
P20/SCL: length 36.5
  Top Layer w0.254: U5.6 70.76,26.14 70.76,21.28 70.18,20.7 U4.10 66.67,20.6 64.69,20.6 63.72,19.62 R30.2 61.76,19.66 49.81,19.66 49.1,20.37 49.1,29.3
P21/SDA: length 30.1
  Top Layer w0.254: 66.75,22 64.24,22 63.5,22.73 R31.2 50.47,22.73 49.9,23.3 49.9,29.3 ; 66.75,22 69.04,22 69.42,22.38 69.42,26.11 U5.5 ; 66.75,22 U4.9
P32: length 41
  Top Layer w0.254: 41.8,32.6 28.49,32.6 25.58,35.51 25.58,52.73 24.99,53.31 21.56,53.31 21.08,53.8 R26.1
P33: length 46.5
  Top Layer w0.254: 41.8,31.8 28.16,31.8 24.78,35.18 24.78,52.26 24.33,52.7 16.69,52.7 16.2,53.19 16.2,55.24 R27.1
P34: length 51.8
  Top Layer w0.254: R28.1 11.33,55.23 11.33,52.76 11.94,52.15 23.44,52.15 23.98,51.61 23.98,34.85 27.82,31 41.8,31
P35: length 62.8
  Top Layer w0.254: 43.5,29.3 43.5,27.62 43.23,27.36 42.62,27.36 42.22,27.76 42.22,29.74 41.83,30.12 27.74,30.12 23.34,34.52 23.34,51.08 22.83,51.59 7.52,51.59 6.45,52.65 6.45,55.22 R29.1
RST: length 43.3
  Top Layer w0.254: C8.1 6.6,47.75 7.7,46.66 7.7,44.92 ; 7.7,44.92 10.97,44.92 R25.1 11.07,44.86 12.95,44.86 14.66,43.15 v1(22.02,43.15) ; 7.7,44.92 S1.1 ; v1(26.92,43.15) 38.1,43.15 38.84,42.42 38.84,39.05 39.69,38.2 41.8,38.2
  Bottom Layer w0.254: v1(22.02,43.15) v1(26.92,43.15)
RXD: length 28.8
  Top Layer w0.254: Q1.3 14.11,27.12 13.82,26.82 12.75,26.82 12.32,27.25 12.32,29.69 11.96,30.05 R3.2 ; v1(16.76,26.82) 16.76,22.68 17.27,22.17 25.55,22.17 26.03,21.69 26.03,18.67
  Bottom Layer w0.254: v1(16.76,26.82) v1(13.22,26.82)
RXD&APOS;: length 28
  Top Layer w0.254: v1(28.37,34.2) 29.45,35.28 33.6,35.28 34.69,34.2 41.8,34.2 ; R2.1 R5.1 21.67,29.86 v1(21.67,31.65)
  Bottom Layer w0.254: v1(28.37,34.2) 22.24,34.2 21.67,33.63 v1(21.67,31.65)
SEGA: length 34.5
  Top Layer w0.254: DS1.1 40,61.36 40.77,62.13 54.81,62.13 56.44,60.5 56.44,53.82 55.04,52.43 52.73,52.43 52.35,52.04 R17.1
SEGB: length 33.7
  Top Layer w0.254: R18.1 49.01,52.77 49.35,53.11 54.84,53.11 55.91,54.18 55.91,60.12 54.43,61.59 42.98,61.59 42.54,61.16 42.54,57 DS1.2
SEGC: length 31.9
  Top Layer w0.254: DS1.3 45.09,57 45.09,60.33 45.67,60.91 54.05,60.91 55.32,59.64 55.32,54.71 54.31,53.7 46.2,53.7 45.67,53.17 R19.1
SEGD: length 30.6
  Top Layer w0.254: R20.1 42.33,53.94 42.7,54.31 53.72,54.31 54.74,55.32 54.74,59.23 53.62,60.35 48.18,60.35 47.6,59.77 47.6,57.02 DS1.4
SEGDP: length 37.4
  Top Layer w0.254: R24.1 28.98,62.89 29.62,63.53 49.71,63.53 50.16,63.98 50.16,67.66 DS1.8
SEGE: length 28.8
  Top Layer w0.254: R21.1 39,54.49 39.4,54.89 53.37,54.89 54.08,55.6 54.08,58.93 53.67,59.33 50.5,59.33 50.16,59 50.16,57 DS1.5
SEGF: length 22.6
  Top Layer w0.254: R22.1 35.66,54.68 36.37,55.4 52.27,55.4 52.71,55.83 52.71,57 DS1.6
SEGG: length 36.6
  Top Layer w0.254: R23.1 32.32,62.34 32.74,62.76 52.04,62.76 52.68,63.4 52.68,67.65 DS1.7
TXD: length 16.7
  Top Layer w0.254: R2.2 18.64,27.53 18.64,23.32 19.2,22.76 26.42,22.76 27.31,21.87 U1.2
TXD&APOS;: length 31.8
  Top Layer w0.254: v1(31.6,33.93) 33.73,33.93 34.22,33.45 41.75,33.45 41.8,33.4 ; v1(22.99,32.97) 13.34,32.97 13.16,32.79 Q1.2
  Bottom Layer w0.254: v1(22.99,32.97) 28.98,32.97 29.95,33.93 v1(31.6,33.93)
UD1+: length 15.6
  Top Layer w0.254: USB1.3 13,18.39 13.8,19.19 13.8,20.86 14.3,21.36 22.39,21.36 23.04,20.72 23.04,19.94 23.5,19.48 23.5,18.67
UD1-: length 15.4
  Top Layer w0.254: U1.6 22.22,19.53 22.63,19.94 22.63,20.55 22.22,20.95 21.51,20.95 21.21,20.65 20.81,20.65 20.5,20.95 19.89,20.95 19.57,20.64 19.21,20.64 18.9,20.95 18.45,20.95 18.17,20.67 17.81,20.67 17.53,20.95 17.07,20.95 16.77,20.65 16.41,20.65 16.13,20.93 15.77,20.93 15.5,20.65 15.14,20.65 14.86,20.93 14.5,20.93 14.2,20.63 14.2,19.19 15,18.39 USB1.2
$1N776: length 5
  Top Layer w0.508: L2.1 R9.1
$1N777: length 5
  Top Layer w0.508: R11.1 83.44,63.44 L4.1
$1N778: length 5
  Top Layer w0.508: L5.1 R12.1
$1N779: length 5
  Top Layer w0.508: L7.1 R14.1
$1N780: length 5
  Top Layer w0.508: L8.1 R15.1
$1N781: length 5
  Top Layer w0.508: L9.1 R16.1
$1N782: length 5
  Top Layer w0.508: L3.1 R10.1
$1N783: length 5
  Top Layer w0.508: L6.1 R13.1
$1N790: length 8.9
  Top Layer w0.254: C1.2 v1(24.77,25.37) ; U1.4 v1(24.77,20.57)
  Bottom Layer w0.254: v1(24.77,20.57) v1(24.77,25.37)
$1N933: length 10.3
  Top Layer w0.254: Q1.1 15.06,26.34 14.55,25.83 12.39,25.83 10.97,27.25 R6.2
$1N948: length 4.1
  Top Layer w0.762: L1.1 R4.1
$1N2567: length 4.4
  Top Layer w0.254: R26.2 Q3.1
$1N2650: length 4.4
  Top Layer w0.254: R27.2 Q4.1
$1N2787: length 4.4
  Top Layer w0.254: R28.2 Q5.1
$1N2856: length 4.4
  Top Layer w0.254: R29.2 Q6.1
$1N2876: length 2.7
  Top Layer w0.254: R8.2 Q2.1
$1N2914: length 13.1
  Top Layer w0.254: Q2.3 80.48,47.06 D1.2 88.32,47.09 88.65,47.42 LS1.1

## Copper pours and planes (outline as drawn; the poured copper is in the pictures)
+3V3 on Top Layer: 39.12,10.49 36.86,10.49 36.6,10.74 36.6,11.63 36.73,11.76 41.2,11.76 42.34,12.9 64.67,12.9 65.28,13.51 68.3,13.51 68.48,13.33 68.48,10.69 68.02,10.24 60.22,10.24 59.41,9.42 56.42,9.42 55.59,10.25 51,10.25 50.11,9.37 42.48,9.37 41.32,10.53 39.15,10.53
+5V on Top Layer: 14,13.61 14,15.86 14.39,16.25 16.69,16.25 16.97,15.98 16.97,11.25 17.35,10.87 34.98,10.87 36.4,9.45 39.5,9.45 39.8,9.14 39.8,7.85 39.62,7.66 31.72,7.66 31.06,7.01 26.95,7.01 26.11,7.85 21.97,7.85 21.28,7.16 17.58,7.16 16.92,6.5 16.92,3.43 16.33,2.84 14.87,2.84 14.16,3.56 14.16,13.45
GND on Top Layer: -4.57,71.32 97.08,71.32 97.08,-2.54 -4.57,-2.54
GND on Bottom Layer: -7.09,73.2 99.82,73.2 99.82,-4.7 -7.09,-4.7

Small or netless copper shapes (teardrops, artwork), in the pictures only: 227 on Top Layer, 22 on Bottom Layer
